# Altium project LEO_COTS_amps_rev1.PrjPcb
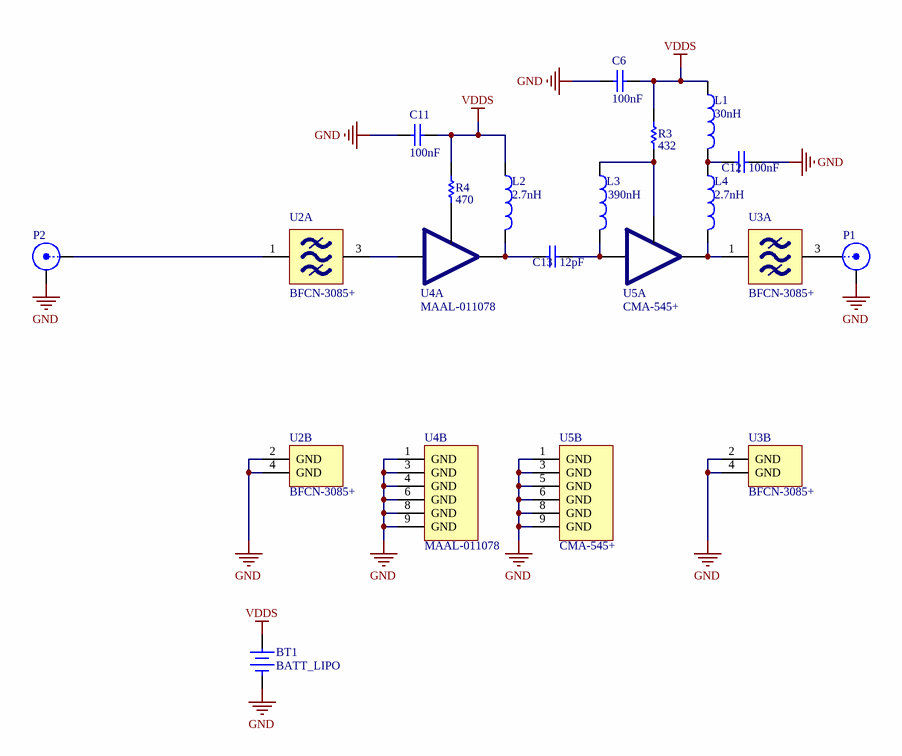
[diagram p0: LEO_COTS_amps_rev1.SchDoc]
1 sheet, 17 parts. Net scope: global (net labels, ports and power ports of the same name join across sheets).
Board file: LEO_COTS_amps_rev1.PcbDoc

## Sheet LEO_COTS_amps_rev1.SchDoc: COTS LEO TX
size A; DocumentNumber: 1; Revision: 1; SheetNumber: 1; SheetTotal: 1

### Parts
BT1  BATT_LIPO  [LIPO_1cm_1cm]
C6  value 100nF  [CAPC0603X04N]  (hidden comment: CAP_0201)
C11  value 100nF  [CAPC0603X04N]  (hidden comment: CAP_0201)
C12  value 100nF  [CAPC0603X04N]  (hidden comment: CAP_0201)
C13  value 12pF  [CAPC0603X04N]  (hidden comment: CAP_0201)
L1  value 30nH  [0402]  (hidden comment: Inductor)
L2  value 2.7nH  [0402]  (hidden comment: Inductor)
L3  value 390nH  [1608[0603]]  (hidden comment: Inductor)
L4  value 2.7nH  [0402]  (hidden comment: Inductor)
P1  1909763-1  [1909763-1]  (value not drawn)
P2  1909763-1  [1909763-1]  (value not drawn)
R3  value 432  [CAPC0603X04N]  (hidden comment: RES_0201)
R4  value 470  [CAPC0603X04N]  (hidden comment: RES_0201)
U2  BFCN-3085+  [FV1206]  (parts A,B of 2)
U3  BFCN-3085+  [FV1206]  (parts A,B of 2)
U4  MAAL-011078  [PDFN-8]  (parts A,B of 2)
U5  CMA-545+  [DL1721]  (parts A,B of 2)

### Nets
GND: BT1.2(-) C6.1 C11.1 C12.1 P1.2(Y) P2.2(Y) U2.2(GND) U2.4(GND) U3.2(GND) U3.4(GND) U4.1(GND) U4.3(GND) U4.4(GND) U4.6(GND) U4.8(GND) U4.9(GND) U5.1(GND) U5.3(GND) U5.5(GND) U5.6(GND) U5.8(GND) U5.9(GND)
VDDS: BT1.1(+) C6.2 C11.2 L1.1 L2.1 R3.2 R4.2
NetC12_2: C12.2 L1.2 L4.1
NetC13_1: C13.1 L3.2 U5.2(IN)
NetC13_2: C13.2 L2.2 U4.7(OUT)
NetL3_1: L3.1 R3.1 U5.4(BIAS)
NetL4_2: L4.2 U3.1(IN) U5.7(OUT)
NetP1_1: P1.1(X) U3.3(OUT)
NetP2_1: P2.1(X) U2.1(IN)
NetR4_1: R4.1 U4.5(BIAS)
NetU2_3: U2.3(OUT) U4.2(IN)

### Notes on the sheet
- Title
- Size:
- Date:
- A
- Number:
- Time:
- Revision:
- Sheet
- of
- File:

### Library data of the parts
C6 C11 C12 = CAP_0201: CAP CER 100nF 0201
C13 = CAP_0201: CAP CER 12pF 0201; Supplier 1: Digi-Key; Supplier Part Number 1: 490-11308-1-ND
L1-L4 = Inductor: Code_IEC: 1005; Published: 8-Jun-2000; LatestRevisionDate: 29-May-2009; LatestRevisionNote: IPC-7351 Footprint Added.; PackageReference: 0402-A; Publisher: Altium Limited; PackageDescription: Chip Inductor; Code_JEITA: 0402; Supplier 1: Digi-Key
  L1: Supplier Part Number 1: 2035-0402HP-300EKTSCT-ND
  L2 L4: Supplier Part Number 1: 2035-1403-1-ND
  L3: Supplier Part Number 1: 490-LQW18CNR39J0ZDCT-ND
P1 P2 = 1909763-1: CONN UMCC JACK STR 50OHM SMD; Supplier 1: Digi-Key; Supplier Part Number 1: A118077CT-ND; Manufacturer Part Number: 1909763-1
R3 R4 = Res Semi: RES 50 OHM 0201; Published: 8-Jun-2000; LatestRevisionDate: 17-Jul-2002; LatestRevisionNote: Re-released for DXP Platform.; PackageReference: AXIAL-0.5; Publisher: Altium Limited; PackageDescription: Axial Device, Thru-Hole; 2 Leads; 0.5 in Pin Spacing; Supplier 1: Digi-Key
  R3: Supplier Part Number 1: P123009CT-ND
  R4: Supplier Part Number 1: P123030CT-ND
U2 U3 = BFCN-3085+: 2800 to 3400 MHz Band-Pass Filter; Supplier 1: Mini-Circuits; Supplier Part Number 1: BFCN-3085+
U4 = MAAL-011078: Wideband LNA; Supplier 1: Digi-Key; Supplier Part Number 1: 1465-1489-1-ND; Manufacturer Part Number: MAAL-011078
U5 = CMA-545+: Wideband LNA; Supplier 1: Mini-Circuits; Supplier Part Number 1: CMA-545+